# Altium schematic sheet Schematic.SchDoc
size A; SheetNumber: 1; SheetTotal: 1
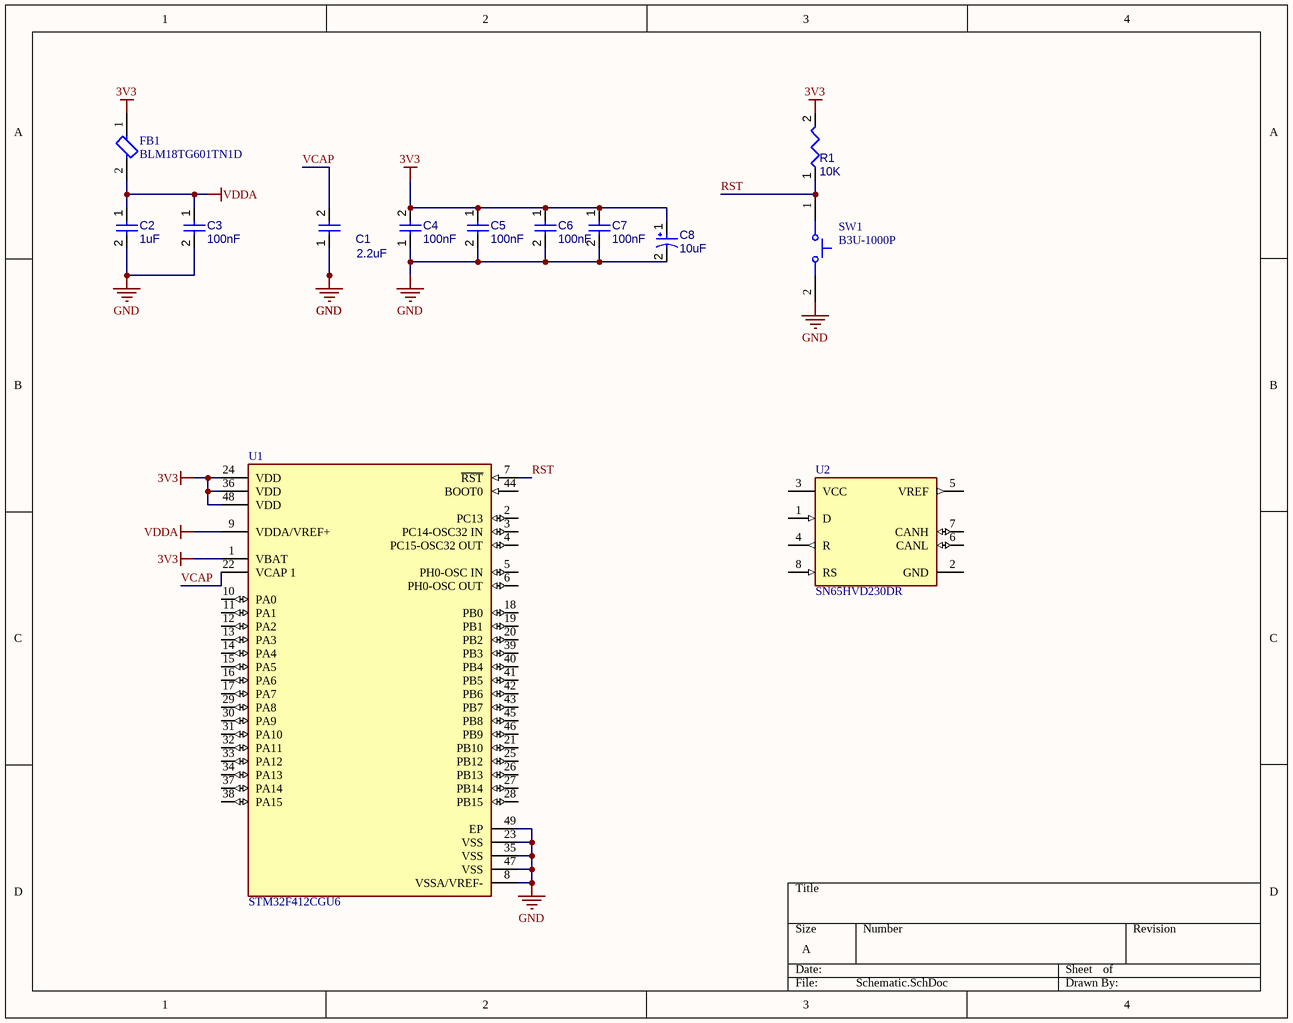
[diagram p0: Schematic.SchDoc]

## Parts
C1  2.2uF  [CAPC0402(1005)60_L]
C2  1uF  [CAPC0402(1005)60_L]
C3  100nF  [CAPC0402(1005)60_L]
C4  100nF  [CAPC0402(1005)60_L]
C5  100nF  [CAPC0402(1005)60_L]
C6  100nF  [CAPC0402(1005)60_L]
C7  100nF  [CAPC0402(1005)60_L]
C8  10uF  [CAPMP3217X18-T_V]
FB1  BLM18TG601TN1D  [FP-BLM18-0_15-0_1-t0_6-MFG]
R1  10K  [RESC0402(1005)_L]
SW1  B3U-1000P  [OMRON-B3U-1000_V]
U1  STM32F412CGU6  [FP-UFQFPN48-A0B9-MFG]
U2  SN65HVD230DR  [FP-D0008A-IPC_A]

## Nets
3V3: C4.2 C5.1 C6.1 C7.1 C8.1 FB1.1 R1.2 U1.1(VBAT) U1.24(VDD) U1.36(VDD) U1.48(VDD)
GND: C1.1 C2.2 C3.2 C4.1 C5.2 C6.2 C7.2 C8.2 SW1.2 U1.8(VSSA/VREF-) U1.23(VSS) U1.35(VSS) U1.47(VSS) U1.49(EP)
VDDA: C2.1 C3.1 FB1.2 U1.9(VDDA/VREF+)
RST: R1.1 SW1.1 U1.7(~{RST})
VCAP: C1.2 U1.22(VCAP_1)

Not connected (* = marked no-connect by the designer): U1 2(PC13) 3(PC14-OSC32_IN) 4(PC15-OSC32_OUT) 5(PH0-OSC_IN) 6(PH0-OSC_OUT) 10(PA0) 11(PA1) 12(PA2) 13(PA3) 14(PA4) 15(PA5) 16(PA6) 17(PA7) 18(PB0) 19(PB1) 20(PB2) 21(PB10) 25(PB12) 26(PB13) 27(PB14) 28(PB15) 29(PA8) 30(PA9) 31(PA10) 32(PA11) 33(PA12) 34(PA13) 37(PA14) 38(PA15) 39(PB3) 40(PB4) 41(PB5) 42(PB6) 43(PB7) 44(BOOT0) 45(PB8) 46(PB9); U2 1(D) 2(GND) 3(VCC) 4(R) 5(VREF) 6(CANL) 7(CANH) 8(RS)

## Library data of the parts
C1 = CMP-001-00056-3: Chip Capacitor, 2,2µF +/-20%, 10V, 0402, Thickness 0.6 mm; Tolerance: 10%; Value: 2.2µF; Case/Package: 0402; Max Operating Temperature: 85°C; Min Operating Temperature: -55°C; Mounting Technology: SMT; Pins: 2; Voltage Rating: 10V
C2 = CMP-001-00063-2: Chip Capacitor, 1µF +/-20%, 10V, 0402, Thickness 0.6 mm; Tolerance: 10%; Max Operating Temperature: 85°C; Case/Package: 0402; Voltage Rating: 10V; Min Operating Temperature: -55°C; Mounting Technology: SMT; Pins: 2; Value: 1µF
C3-C7 = CMP-001-00061-2: Chip Capacitor, 100nF +/-20%, 10V, 0402, Thickness 0.6 mm; Tolerance: 20%; Max Operating Temperature: 85°C; Min Operating Temperature: -55°C; Voltage Rating: 10V; Case/Package: 0402; Mounting Technology: SMT; Pins: 2; Value: 100nF
C8 = CMP-001-00041-6: Standard Tantalum, 10 uF, +/- 10%, 16 V, -55 to 125 degC, 1206 (3216 Metric), RoHS, Tape and Reel; Manufacturer: AVX; ESR: 3Ohm; Value: 10µF; Voltage Rating: 16V; Manufacturer URL: http://www.avx.com/; Datasheet URL: http://datasheets.avx.com/TAJ.pdf; Package Reference: CAPMP3217X18-T; Packaging: TapeandReel; Package Description: 2-Pin Surface Mount Device, Body 3.2 x 1.65 mm; Tolerance: 10%; Datasheet Version: Feb-16; Capacitor Type: Tantalum; Case/Package: 1206; Max Operating Temperature: 125°C; Min Operating Temperature: -55°C; Mounting Technology: SM; Package Quantity: 1; Package URL: http://www.avx.com/download/software/literature/AVX-Footprint-Library.pdf; Pins: 2; RoHS Compliant: True
FB1 = CMP-0686-00527-3: FERRITE BEAD 600 OHM 0603 1LN; Current Rating: 200mA; Test Frequency: 100MHz; Tolerance: 25%; Impedance: 600R; DC Resistance (DCR): 450mR; Number of Lines: 1; Material: Steel; Number of Pins: 2; Height: 0.8mm; Max Operating Temperature: 125°C; Case Code (Imperial): 0603; Case/Package: 0603; REACH SVHC: No SVHC; Max Current Rating: 200mA; Width: 0.8mm; Package Quantity: 10000; Depth: 0.8mm; Length: 1.6mm; Lead Free: Lead Free; Max DC Current: 200mA; Min Operating Temperature: -55°C; Number of Circuits: 1; Termination: SMD/SMT; Case Code (Metric): 1608; Packaging: Tape and Reel
R1 = CMP-009-00149-2: Chip Resistor, 10 kOhms, +/-1 %, 63 mW, -55 to 125 degC, 0402; Power: 63mW; Tolerance: 1%; Max Operating Temperature: 155°C; Min Operating Temperature: -55°C; Case/Package: 0402; Pins: 2; Value: 10k
SW1 = CMP-011-00000-1: Tactile Switch, SPST-NO, 0.05 A, 12 V, -25 to 70 degC, 2-Pin SMD, RoHS, Tape and Reel; Manufacturer: Omron Electronic Components; Current Rating: 50mA; Voltage Rating (DC): 12V; Operating Force: 153gf; Throw Configuration: SPST; IP Rating: IP40; Max Contact Resistance: 100mohm; Resistance: 0.1Ohm; Packaging: TapeandReel; Max Operating Temperature: 70°C; Package Description: 2-Pin Surface Mount Device, Body 3 x 2.5 mm; Manufacturer URL: http://www.omron.com/; Contact Material: Silver; Mounting Technology: SM; Contact Current Rating: 50mA; Datasheet Version: Jan-15; Datasheet URL: http://www.omron.com/ecb/products/pdf/en-b3u.pdf; Package Reference: B3U-1000; Min Operating Temperature: -25°C; Max Voltage Rating (DC): 12V; Package Quantity: 3500; Case/Package: B3U-1000; Max Current Rating: 50mA; RoHS Compliant: True; Voltage Rating: 12V
U1 = CMP-12105-000086-1: IC MCU 32BIT 1MB FLASH 48UFQFPN; Frequency: 100MHz; Peripherals: Brown-out Detect/Reset; Number of I/Os: 36; Interface: I2C; Core Architecture: ARM; Oscillator Type: Internal; Memory Type: FLASH; Memory Size: 1MB; Min Operating Temperature: -40°C; Max Operating Temperature: 85°C
U2 = CMP-0315-00015-3: IC TRANSCEIVER HALF 1/1 8SOIC; Number of Transceivers: 1; Operating Supply Voltage: 3.3V; Number of I/Os: 2; Max Supply Current: 17mA; Max Supply Voltage: 3.6V; Min Supply Voltage: 3V; Data Rate: 1Mbps; Min Operating Temperature: -40°C; Packaging: Tape and Reel; Lead Free: Lead Free; Number of Transmit Buffers: 1; Max Operating Temperature: 85°C; Number of Receive Buffers: 1; Number of Pins: 8; Package Quantity: 1; Radiation Hardening: No; Case/Package: D; REACH SVHC: No SVHC; Weight: 0.002561oz; Termination: SMD/SMT; Contact Plating: Gold; Nominal Supply Current: 17mA; Number of Receivers: 1; Number of Drivers: 1